# EasyEDA schematic andres-rgb-controller-esp8266-12_2021-06-23_19-22-37.json
TITLE: Sheet_1; REV: 1.0; Date: 2021-05-24; Sheet: 1/1; Drawn By: alilakho; Company: Your Company
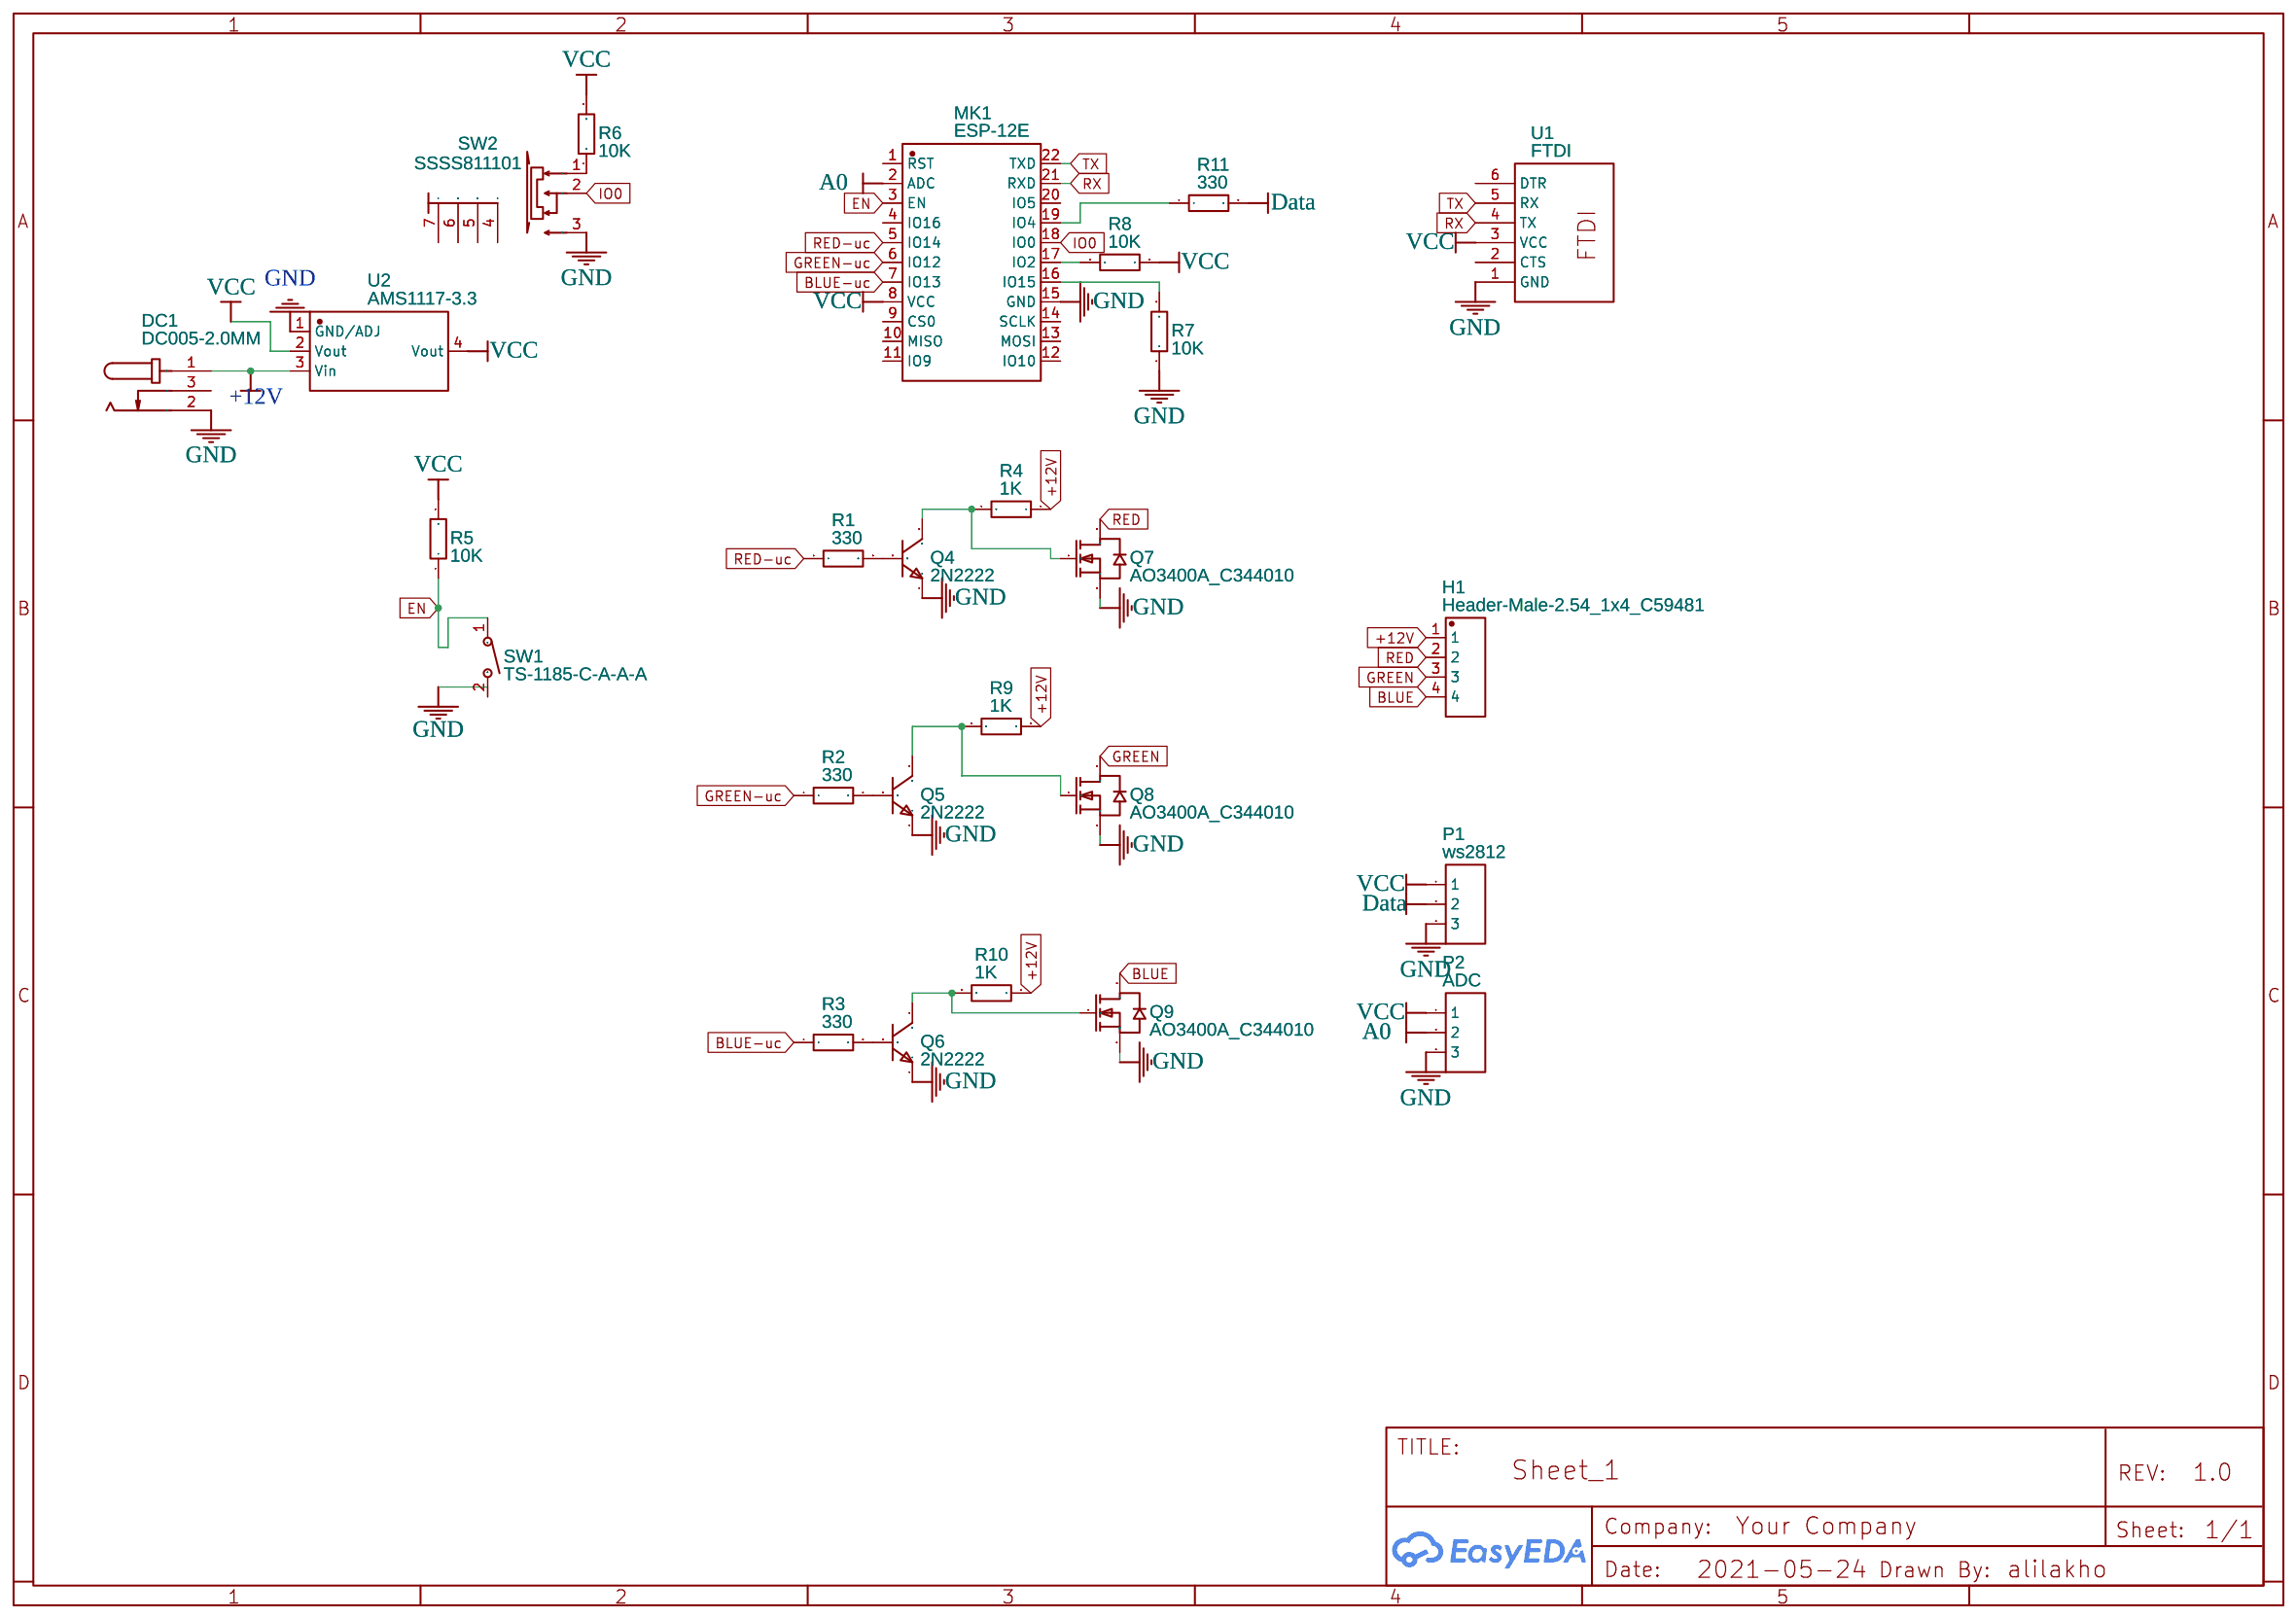
[diagram p0: schematic sheet]

## Parts
DC1  DC005-2.0MM  [DC-IN-TH_DC005]
H1  Header-Male-2.54_1x4_C59481  [HDR-TH_4P-P2.54-V]
MK1  ESP-12E  [WIFIM-SMD_ESP-12E]
P1  ws2812  [HDR-TH_3P-P2.54-V-F]
P2  ADC  [HDR-TH_3P-P2.54-V-F]
Q4  2N2222  [TO-92-3_L4.9-W3.7-P1.27-L]
Q5  2N2222  [TO-92-3_L4.9-W3.7-P1.27-L]
Q6  2N2222  [TO-92-3_L4.9-W3.7-P1.27-L]
Q7  AO3400A_C344010  [SOT-23_L2.9-W1.3-P1.90-LS2.4-BR]
Q8  AO3400A_C344010  [SOT-23_L2.9-W1.3-P1.90-LS2.4-BR]
Q9  AO3400A_C344010  [SOT-23_L2.9-W1.3-P1.90-LS2.4-BR]
R1  330  [R0805]
R2  330  [R0805]
R3  330  [R0805]
R4  1K  [R1210]
R5  10K  [R1206]
R6  10K  [R1206]
R7  10K  [R1206]
R8  10K  [R1206]
R9  1K  [R1210]
R10  1K  [R1210]
R11  330  [R0805]
SW1  TS-1185-C-A-A-A  [SW-SMD_L4.0-W3.0-LS5.0-EH]
SW2  SSSS811101  [SW-SMD_SSSS811101]
U1  FTDI  [FTDI_PROG]
U2  AMS1117-3.3  [SOT-223-3_L6.5-W3.4-P2.30-LS7.0-BR]

## Library data of the parts
DC1 = DC005-2.0MM: Supplier: LCSC; Manufacturer: SOFNG; Supplier Part: C111567
H1 = Header-Male-2.54_1x4_C59481: Supplier: LCSC; Manufacturer: ReliaPro; Manufacturer Part: Headers  Pins 1*4P; Supplier Part: C59481
MK1 = ESP-12E: Supplier: LCSC; Manufacturer: Ai-Thinker; Supplier Part: C89297; JLCPCB Part Class: Extended Part
P1 P2 = Header-Female-2.54_1x3: Supplier Part: C146243; Supplier: LCSC; Manufacturer: Boom Precision Elec; link: https://datasheet.lcsc.com/szlcsc/Boom-Precision-Elec-2-54mm-1-8P-Straight-Female-header_C27438.pdf; JLCPCB Part Class: Extended Part
Q4-Q6 = 2N2222: Supplier: LCSC; Manufacturer: SEMTECH; Contributor: LCSC; Supplier Part: C118536; JLCPCB Part Class: Extended Part
Q7-Q9 = AO3400A_C344010: Supplier: LCSC; Supplier Part: C344010; Manufacturer: Bourne Semicon (Shenzhen); Manufacturer Part: AO3400A; Contributor: LCSC; JLCPCB Part Class: Extended Part
R1-R3 R11 = 0805W8J0331T5E: Supplier: LCSC; Manufacturer: UniOhm; Supplier Part: C25306; JLCPCB Part Class: Extended Part
R4 R9 R10 = 1210W3J0102T5E: Supplier: LCSC; Manufacturer: UniOhm; Supplier Part: C25681; JLCPCB Part Class: Extended Part
R5-R8 = 1206W4F1002T5E: Supplier: LCSC; Manufacturer: UniOhm; Supplier Part: C17902; JLCPCB Part Class: Basic Part
SW1 = TS-1185-C-A-A-A: Supplier: LCSC; Supplier Part: C561518; Manufacturer: XKB Enterprise; Contributor: LCSC; JLCPCB Part Class: Extended Part
SW2 = SSSS811101: Supplier: LCSC; Manufacturer: ALPS; Supplier Part: C109335; JLCPCB Part Class: Extended Part
U1 = FTDI: Contributor: nematic.business
U2 = AMS1117-3.3: sourceId: dwIGgezVh; Supplier: LCSC; Manufacturer: AMS; Supplier Part: C6186; JLCPCB Part Class: Basic Part

## Nets
+12V: DC1.1 H1.1 R4.1 R9.1 R10.1 U2.3(Vin)
GND: DC1.2 MK1.15(GND) P1.3 P2.3 Q4.1(E) Q5.1(E) Q6.1(E) Q7.2(S) Q8.2(S) Q9.2(S) R7.1 SW1.2 SW2.3 U1.1(GND) U2.1(GND/ADJ)
VCC: MK1.8(VCC) P1.1 P2.1 R5.2 R6.2 R8.1 U1.3(VCC) U2.2(Vout) U2.4(Vout)
A0: MK1.2(ADC) P2.2
BLUE: H1.4 Q9.3(D)
BLUE-uc: MK1.7(IO13) R3.1
Data: P1.2 R11.2
EN: MK1.3(EN) R5.1 SW1.1
GREEN: H1.3 Q8.3(D)
GREEN-uc: MK1.6(IO12) R2.1
IO0: MK1.18(IO0) SW2.2
RED: H1.2 Q7.3(D)
RED-uc: MK1.5(IO14) R1.1
RX: MK1.21(RXD) U1.4(TX)
TX: MK1.22(TXD) U1.5(RX)
Net-(MK1-16): MK1.16(IO15) R7.2
Net-(MK1-17): MK1.17(IO2) R8.2
Net-(MK1-19): MK1.19(IO4) R11.1
Net-(Q4-2): Q4.2(B) R1.2
Net-(Q4-3): Q4.3(C) Q7.1(G) R4.2
Net-(Q5-2): Q5.2(B) R2.2
Net-(Q5-3): Q5.3(C) Q8.1(G) R9.2
Net-(Q6-2): Q6.2(B) R3.2
Net-(Q6-3): Q6.3(C) Q9.1(G) R10.2
Net-(R6-1): R6.1 SW2.1

Not connected (* = marked no-connect by the designer): DC1 3; MK1 1(RST) 4(IO16) 9(CS0) 10(MISO) 11(IO9) 12(IO10) 13(MOSI) 14(SCLK) 20(IO5); SW2 4 5 6 7; U1 2(CTS) 6(DTR)
